# EAGLE design TMP-ASM-001 (EAGLE 9.6.2)
CNAME: Cat-Ion; CREVISION: 1.0.0; DESIGNER: Matt Starfield

## Sheet 1 of 2: MCU / Power / Mech
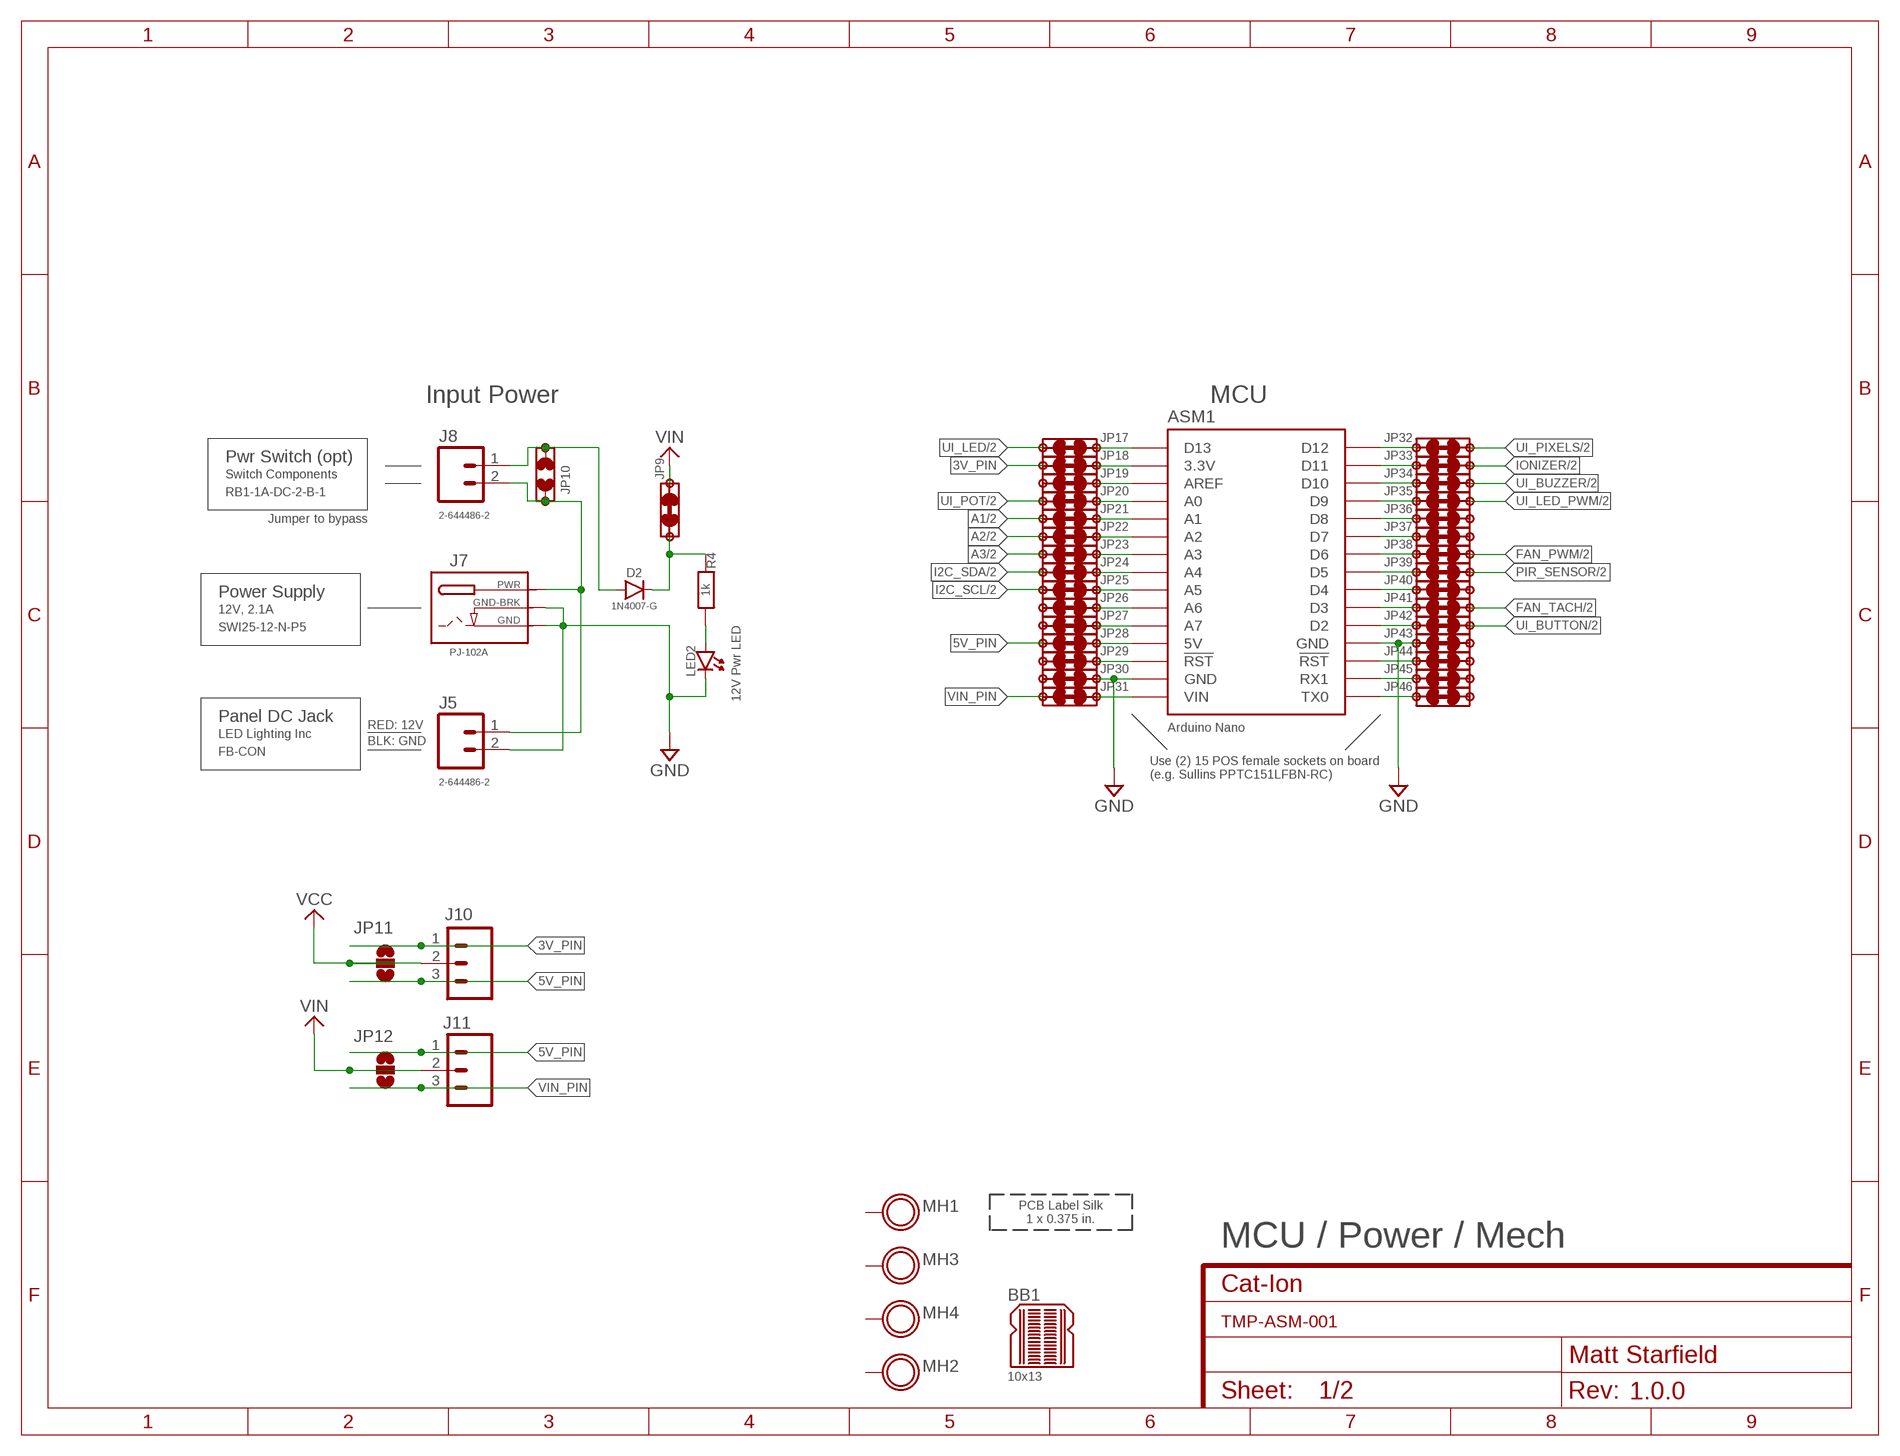
[diagram p0: schematic, sheet 1]

### Parts
ASM1  ASM_ARDUINO_NANO_NO-ICSP-LOCKING  [ASM_ARDUINO_NANO_NO-ICSP_LOCKING]
BB1  10x13  PCB_MECH_BREADBOARD_PATTERN-PROTO_10X13  [BREADBOARD_PROTO_10X13]
D2  1N4007-G  DIO_DIODE-1N4007-PTH  [DIODE-1N4007]
J5  2-644486-2  CON_HEADER_1X2-TE_MTA-100_PTH_SHROUDED  [TE_MTA-100_2POS-PTH-VERT]
J7  PJ-102A  CON_DC_BARREL_JACK-1MM-DRILL_THT_LOCKING  [DCJACK_2MM-PIN,1MM-DRILL_THT_LOCKING]
J8  2-644486-2  CON_HEADER_1X2-TE_MTA-100_PTH_SHROUDED  [TE_MTA-100_2POS-PTH-VERT]
J10  CON_HEADER_1X3LOCK  [1X03_LOCK]
J11  CON_HEADER_1X3LOCK  [1X03_LOCK]
JP9  CON_JUMPER_PTH-2-NC-0.25W_RES_VERT_DRC-FRIENDLY  [CON_JUMPER_NC_RES_VERT-0.4_DRC-FRIENDLY]
JP10  CON_JUMPER_PTH-2-NO-DRC_FRIENDLY  [CON_JUMPER_NO_RES_VERT-0.4_DRC-FRIENDLY]
JP11  CON_JUMPER_PAD-3-ALL_NOFULL_BOX_SILK  [PAD-JUMPER-3-NO_YES_SILK_FULL_BOX]
JP12  CON_JUMPER_PAD-3-ALL_NOFULL_BOX_SILK  [PAD-JUMPER-3-NO_YES_SILK_FULL_BOX]
JP17  CON_JUMPER_PTH-2-NC-0.25W_RES_VERT_DRC-FRIENDLY  [CON_JUMPER_NC_RES_VERT-0.4_DRC-FRIENDLY]
JP18  CON_JUMPER_PTH-2-NC-0.25W_RES_VERT_DRC-FRIENDLY  [CON_JUMPER_NC_RES_VERT-0.4_DRC-FRIENDLY]
JP19  CON_JUMPER_PTH-2-NC-0.25W_RES_VERT_DRC-FRIENDLY  [CON_JUMPER_NC_RES_VERT-0.4_DRC-FRIENDLY]
JP20  CON_JUMPER_PTH-2-NC-0.25W_RES_VERT_DRC-FRIENDLY  [CON_JUMPER_NC_RES_VERT-0.4_DRC-FRIENDLY]
JP21  CON_JUMPER_PTH-2-NC-0.25W_RES_VERT_DRC-FRIENDLY  [CON_JUMPER_NC_RES_VERT-0.4_DRC-FRIENDLY]
JP22  CON_JUMPER_PTH-2-NC-0.25W_RES_VERT_DRC-FRIENDLY  [CON_JUMPER_NC_RES_VERT-0.4_DRC-FRIENDLY]
JP23  CON_JUMPER_PTH-2-NC-0.25W_RES_VERT_DRC-FRIENDLY  [CON_JUMPER_NC_RES_VERT-0.4_DRC-FRIENDLY]
JP24  CON_JUMPER_PTH-2-NC-0.25W_RES_VERT_DRC-FRIENDLY  [CON_JUMPER_NC_RES_VERT-0.4_DRC-FRIENDLY]
JP25  CON_JUMPER_PTH-2-NC-0.25W_RES_VERT_DRC-FRIENDLY  [CON_JUMPER_NC_RES_VERT-0.4_DRC-FRIENDLY]
JP26  CON_JUMPER_PTH-2-NC-0.25W_RES_VERT_DRC-FRIENDLY  [CON_JUMPER_NC_RES_VERT-0.4_DRC-FRIENDLY]
JP27  CON_JUMPER_PTH-2-NC-0.25W_RES_VERT_DRC-FRIENDLY  [CON_JUMPER_NC_RES_VERT-0.4_DRC-FRIENDLY]
JP28  CON_JUMPER_PTH-2-NC-0.25W_RES_VERT_DRC-FRIENDLY  [CON_JUMPER_NC_RES_VERT-0.4_DRC-FRIENDLY]
JP29  CON_JUMPER_PTH-2-NC-0.25W_RES_VERT_DRC-FRIENDLY  [CON_JUMPER_NC_RES_VERT-0.4_DRC-FRIENDLY]
JP30  CON_JUMPER_PTH-2-NC-0.25W_RES_VERT_DRC-FRIENDLY  [CON_JUMPER_NC_RES_VERT-0.4_DRC-FRIENDLY]
JP31  CON_JUMPER_PTH-2-NC-0.25W_RES_VERT_DRC-FRIENDLY  [CON_JUMPER_NC_RES_VERT-0.4_DRC-FRIENDLY]
JP32  CON_JUMPER_PTH-2-NC-0.25W_RES_VERT_DRC-FRIENDLY  [CON_JUMPER_NC_RES_VERT-0.4_DRC-FRIENDLY]
JP33  CON_JUMPER_PTH-2-NC-0.25W_RES_VERT_DRC-FRIENDLY  [CON_JUMPER_NC_RES_VERT-0.4_DRC-FRIENDLY]
JP34  CON_JUMPER_PTH-2-NC-0.25W_RES_VERT_DRC-FRIENDLY  [CON_JUMPER_NC_RES_VERT-0.4_DRC-FRIENDLY]
JP35  CON_JUMPER_PTH-2-NC-0.25W_RES_VERT_DRC-FRIENDLY  [CON_JUMPER_NC_RES_VERT-0.4_DRC-FRIENDLY]
JP36  CON_JUMPER_PTH-2-NC-0.25W_RES_VERT_DRC-FRIENDLY  [CON_JUMPER_NC_RES_VERT-0.4_DRC-FRIENDLY]
JP37  CON_JUMPER_PTH-2-NC-0.25W_RES_VERT_DRC-FRIENDLY  [CON_JUMPER_NC_RES_VERT-0.4_DRC-FRIENDLY]
JP38  CON_JUMPER_PTH-2-NC-0.25W_RES_VERT_DRC-FRIENDLY  [CON_JUMPER_NC_RES_VERT-0.4_DRC-FRIENDLY]
JP39  CON_JUMPER_PTH-2-NC-0.25W_RES_VERT_DRC-FRIENDLY  [CON_JUMPER_NC_RES_VERT-0.4_DRC-FRIENDLY]
JP40  CON_JUMPER_PTH-2-NC-0.25W_RES_VERT_DRC-FRIENDLY  [CON_JUMPER_NC_RES_VERT-0.4_DRC-FRIENDLY]
JP41  CON_JUMPER_PTH-2-NC-0.25W_RES_VERT_DRC-FRIENDLY  [CON_JUMPER_NC_RES_VERT-0.4_DRC-FRIENDLY]
JP42  CON_JUMPER_PTH-2-NC-0.25W_RES_VERT_DRC-FRIENDLY  [CON_JUMPER_NC_RES_VERT-0.4_DRC-FRIENDLY]
JP43  CON_JUMPER_PTH-2-NC-0.25W_RES_VERT_DRC-FRIENDLY  [CON_JUMPER_NC_RES_VERT-0.4_DRC-FRIENDLY]
JP44  CON_JUMPER_PTH-2-NC-0.25W_RES_VERT_DRC-FRIENDLY  [CON_JUMPER_NC_RES_VERT-0.4_DRC-FRIENDLY]
JP45  CON_JUMPER_PTH-2-NC-0.25W_RES_VERT_DRC-FRIENDLY  [CON_JUMPER_NC_RES_VERT-0.4_DRC-FRIENDLY]
JP46  CON_JUMPER_PTH-2-NC-0.25W_RES_VERT_DRC-FRIENDLY  [CON_JUMPER_NC_RES_VERT-0.4_DRC-FRIENDLY]
LED2  LED_THT-3MM_LOCKING  [LED3MM]
MH1  PCB_MOUNTING-HOLE_PLATED-0.129-IN_#4_FREE-FIT  [MOUNTING_HOLE_0.129-IN_#4_FREE-FIT_PLATED]
MH2  PCB_MOUNTING-HOLE_PLATED-0.129-IN_#4_FREE-FIT  [MOUNTING_HOLE_0.129-IN_#4_FREE-FIT_PLATED]
MH3  PCB_MOUNTING-HOLE_PLATED-0.129-IN_#4_FREE-FIT  [MOUNTING_HOLE_0.129-IN_#4_FREE-FIT_PLATED]
MH4  PCB_MOUNTING-HOLE_PLATED-0.129-IN_#4_FREE-FIT  [MOUNTING_HOLE_0.129-IN_#4_FREE-FIT_PLATED]
R4  1k  RES_RESISTOR-PTH-1/4W_TIGHT  [AXIAL-0.3_TIGHT]
U$66  PCB_IMG_LABEL_SILK-1X0.375_IN  [LABEL_SILK_1X0.375_IN]

### Nets
3V_PIN: J10.1 JP11.1 JP18.P1
5V_PIN: J10.3 J11.1 JP11.3 JP12.1 JP28.P1
A1: JP21.P1 ; also sheet 2
A2: JP22.P1 ; also sheet 2
A3: JP23.P1 ; also sheet 2
FAN_PWM: JP38.P1 ; also sheet 2
FAN_TACH: JP41.P1 ; also sheet 2
GND: ASM1.GND@14(GND) ASM1.GND@19(GND) J5.2 J7.2(GND) J7.3(GND-BRK) JP30.P2 JP43.P2 LED2.CAT(C) ; supply symbol labelled V0_GND ; also sheet 2
I2C_SCL: JP25.P1 ; also sheet 2
I2C_SDA: JP24.P1 ; also sheet 2
IONIZER: JP33.P1 ; also sheet 2
N$1: ASM1.D12 JP32.P2
N$2: ASM1.D11 JP33.P2
N$3: ASM1.D10 JP34.P2
N$4: ASM1.D9 JP35.P2
N$5: LED2.AN(A) R4.P$1(P1)
N$6: ASM1.D8 JP36.P2
N$7: ASM1.D7 JP37.P2
N$8: ASM1.D6 JP38.P2
N$9: ASM1.D5 JP39.P2
N$10: ASM1.D4 JP40.P2
N$11: ASM1.D3 JP41.P2
N$12: ASM1.D2 JP42.P2
N$14: ASM1.RST@18(!RST!) JP44.P2
N$15: ASM1.RX1 JP45.P2
N$16: ASM1.TX0 JP46.P2
N$17: ASM1.D13 JP17.P2
N$18: J5.1 J7.1(PWR) J8.2 JP10.P1
N$19: D2.A J8.1 JP10.P2
N$20: ASM1.3.3V JP18.P2
N$24: ASM1.AREF JP19.P2
N$25: ASM1.A0 JP20.P2
N$26: ASM1.A1 JP21.P2
N$27: ASM1.A2 JP22.P2
N$28: ASM1.A3 JP23.P2
N$29: ASM1.A4 JP24.P2
N$30: ASM1.A5 JP25.P2
N$31: ASM1.A6 JP26.P2
N$33: ASM1.A7 JP27.P2
N$34: ASM1.5V JP28.P2
N$35: ASM1.RST@13(!RST!) JP29.P2
N$37: ASM1.VIN JP31.P2
N$56: D2.C JP9.P1 R4.P$2(P2)
PIR_SENSOR: JP39.P1 ; also sheet 2
UI_BUTTON: JP42.P1 ; also sheet 2
UI_BUZZER: JP34.P1 ; also sheet 2
UI_LED: JP17.P1 ; also sheet 2
UI_LED_PWM: JP35.P1 ; also sheet 2
UI_PIXELS: JP32.P1 ; also sheet 2
UI_POT: JP20.P1 ; also sheet 2
VCC: J10.2 JP11.2 ; also sheet 2
VIN: J11.2 JP9.P2 JP12.2 ; also sheet 2
VIN_PIN: J11.3 JP12.3 JP31.P1
Unconnected: JP19.P1 JP26.P1 JP27.P1 JP29.P1 JP30.P1 JP36.P1 JP37.P1 JP40.P1 JP43.P1 JP44.P1 JP45.P1 JP46.P1 MH1.P$1(P1) MH2.P$1(P1) MH3.P$1(P1) MH4.P$1(P1)

### Notes on the sheet
- Input Power | MCU
- Pwr Switch (opt)
- Switch Components
- RB1-1A-DC-2-B-1
- Jumper to bypass
- Power Supply
- 12V, 2.1A
- SWI25-12-N-P5 | 12V Pwr LED
- Panel DC Jack
- RED: 12V
- LED Lighting Inc
- BLK: GND
- FB-CON
- Use (2) 15 POS female sockets on board
  (e.g. Sullins PPTC151LFBN-RC)
- MCU / Power / Mech

## Sheet 2 of 2: Input / Output
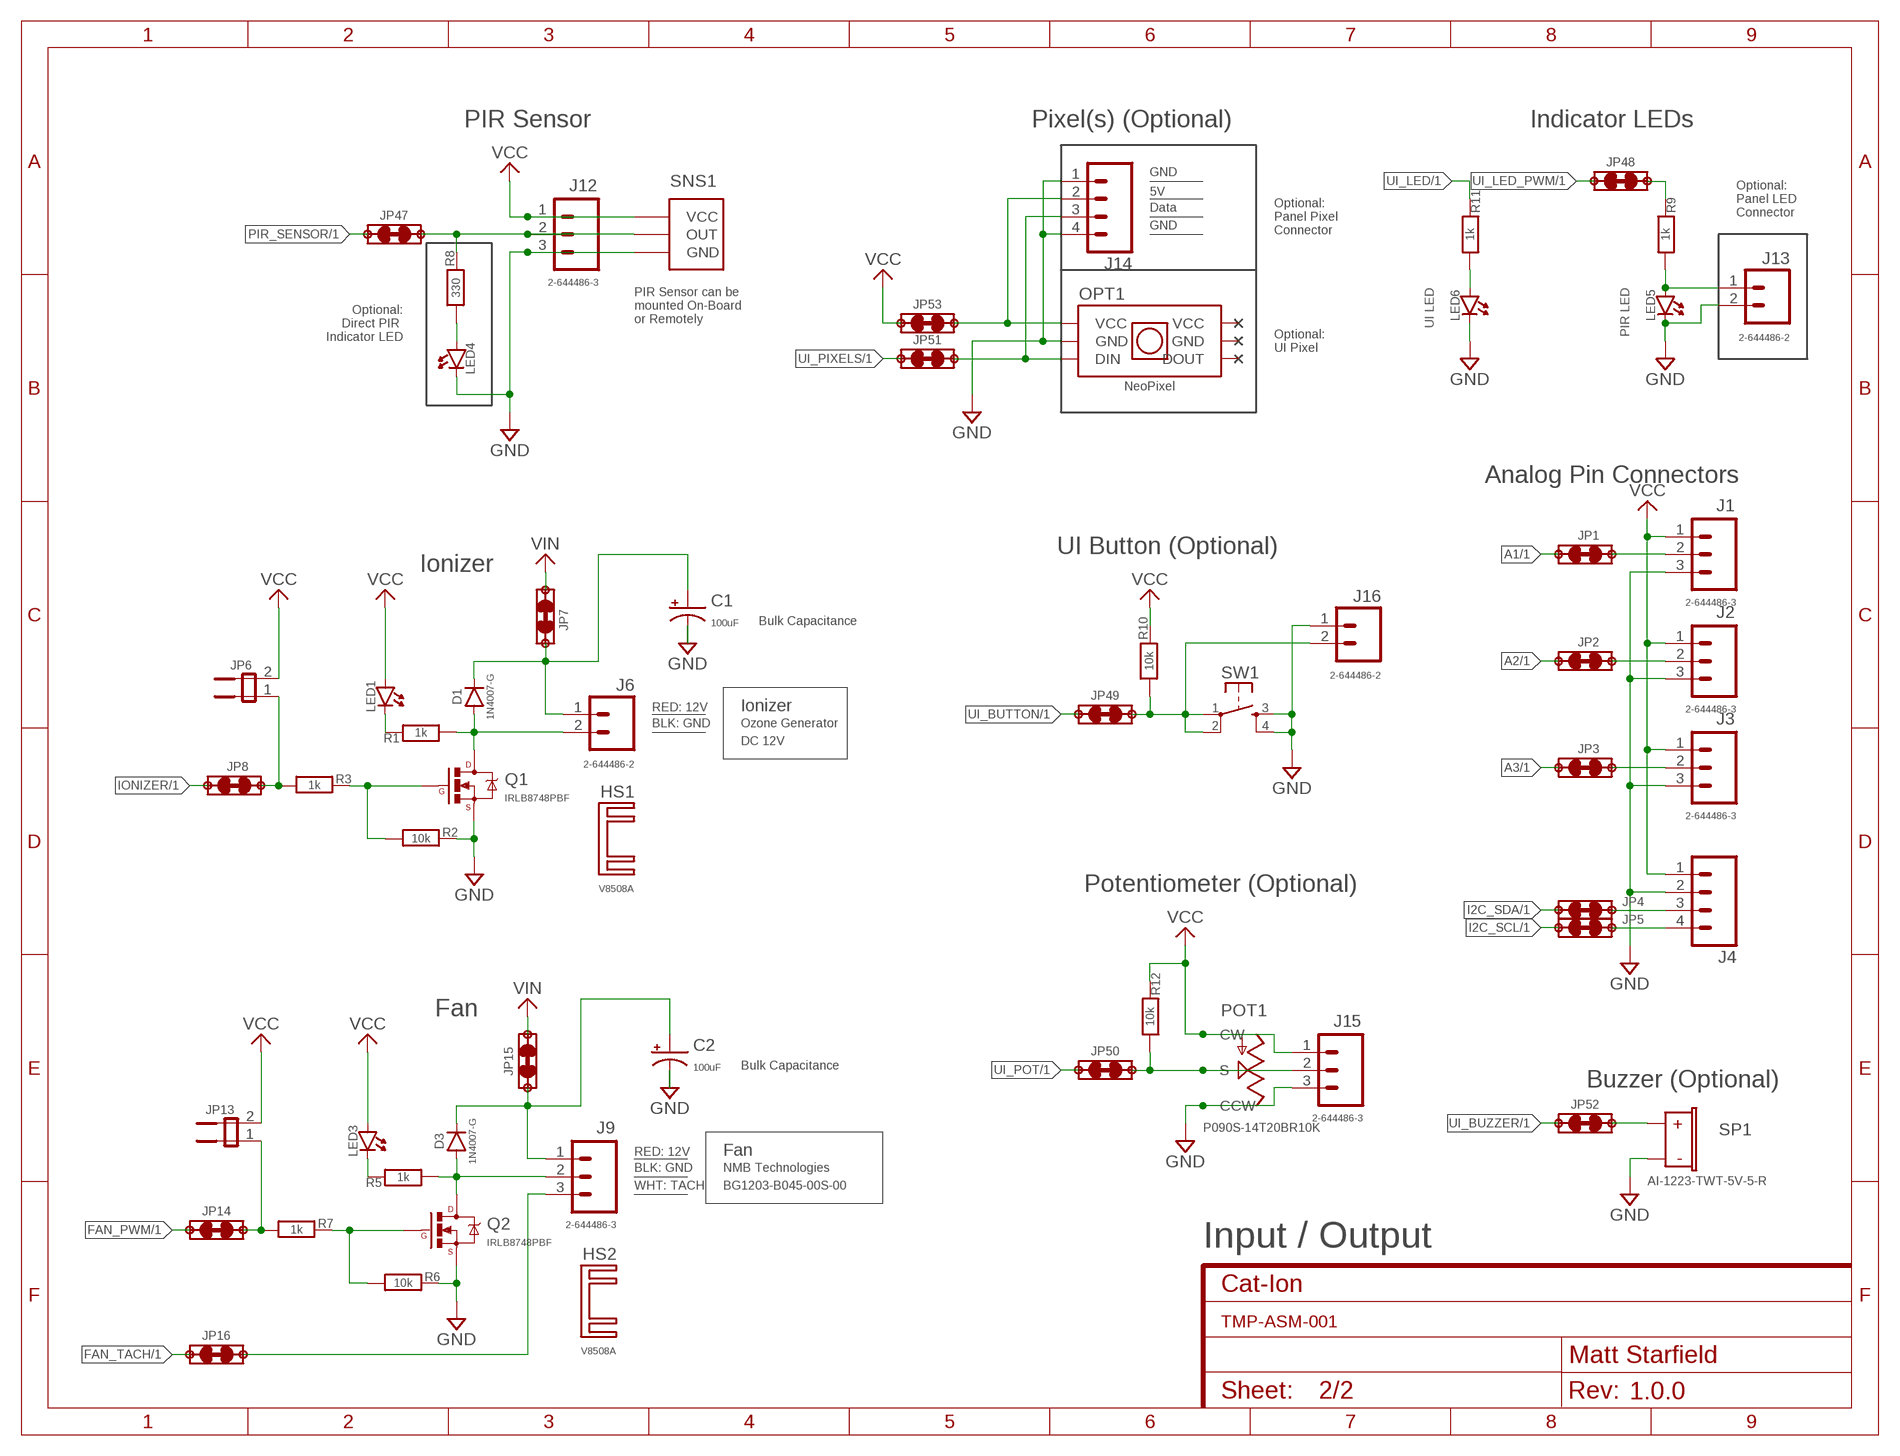
[diagram p1: schematic, sheet 2]

### Parts
C1  100uF  CAP_THT_POL-RAD-E_8MM-D_X_3MM-LEAD_POL  [CAP-E_8MM-DIA_X_3MM-LEAD]
C2  100uF  CAP_THT_POL-RAD-E_8MM-D_X_3MM-LEAD_POL  [CAP-E_8MM-DIA_X_3MM-LEAD]
D1  1N4007-G  DIO_DIODE-1N4007-PTH  [DIODE-1N4007]
D3  1N4007-G  DIO_DIODE-1N4007-PTH  [DIODE-1N4007]
HS1  V8508A  MEC_HEATSINK_NO-PIN-V8508  [HEATSINK_V8508]
HS2  V8508A  MEC_HEATSINK_NO-PIN-V8508  [HEATSINK_V8508]
J1  2-644486-3  CON_HEADER_1X3TE_MTA-100_3POS-PTH-VERT_SHROUDED  [TE_MTA-100_3POS-PTH-VERT]
J2  2-644486-3  CON_HEADER_1X3TE_MTA-100_3POS-PTH-VERT_SHROUDED  [TE_MTA-100_3POS-PTH-VERT]
J3  2-644486-3  CON_HEADER_1X3TE_MTA-100_3POS-PTH-VERT_SHROUDED  [TE_MTA-100_3POS-PTH-VERT]
J4  CON_HEADER_1X4-TE_MTA-100_PTH_SHROUDED  [TE_MTA-100_4POS-PTH-VERT]
J6  2-644486-2  CON_HEADER_1X2-TE_MTA-100_PTH_SHROUDED  [TE_MTA-100_2POS-PTH-VERT]
J9  2-644486-3  CON_HEADER_1X3TE_MTA-100_3POS-PTH-VERT_SHROUDED  [TE_MTA-100_3POS-PTH-VERT]
J12  2-644486-3  CON_HEADER_1X3TE_MTA-100_3POS-PTH-VERT_SHROUDED  [TE_MTA-100_3POS-PTH-VERT]
J13  2-644486-2  CON_HEADER_1X2-TE_MTA-100_PTH_SHROUDED  [TE_MTA-100_2POS-PTH-VERT]
J14  CON_HEADER_1X4-TE_MTA-100_PTH_SHROUDED  [TE_MTA-100_4POS-PTH-VERT]
J15  2-644486-3  CON_HEADER_1X3TE_MTA-100_3POS-PTH-VERT_SHROUDED  [TE_MTA-100_3POS-PTH-VERT]
J16  2-644486-2  CON_HEADER_1X2-TE_MTA-100_PTH_SHROUDED  [TE_MTA-100_2POS-PTH-VERT]
JP1  CON_JUMPER_PTH-2-NC-0.25W_RES_VERT_DRC-FRIENDLY  [CON_JUMPER_NC_RES_VERT-0.4_DRC-FRIENDLY]
JP2  CON_JUMPER_PTH-2-NC-0.25W_RES_VERT_DRC-FRIENDLY  [CON_JUMPER_NC_RES_VERT-0.4_DRC-FRIENDLY]
JP3  CON_JUMPER_PTH-2-NC-0.25W_RES_VERT_DRC-FRIENDLY  [CON_JUMPER_NC_RES_VERT-0.4_DRC-FRIENDLY]
JP4  CON_JUMPER_PTH-2-NC-0.25W_RES_VERT_DRC-FRIENDLY  [CON_JUMPER_NC_RES_VERT-0.4_DRC-FRIENDLY]
JP5  CON_JUMPER_PTH-2-NC-0.25W_RES_VERT_DRC-FRIENDLY  [CON_JUMPER_NC_RES_VERT-0.4_DRC-FRIENDLY]
JP6  CON_JUMPER_PIN_1X2-LOCKING  [1X02_LOCK]
JP7  CON_JUMPER_PTH-2-NC-0.25W_RES_VERT_DRC-FRIENDLY  [CON_JUMPER_NC_RES_VERT-0.4_DRC-FRIENDLY]
JP8  CON_JUMPER_PTH-2-NC-0.25W_RES_VERT_DRC-FRIENDLY  [CON_JUMPER_NC_RES_VERT-0.4_DRC-FRIENDLY]
JP13  CON_JUMPER_PIN_1X2-LOCKING  [1X02_LOCK]
JP14  CON_JUMPER_PTH-2-NC-0.25W_RES_VERT_DRC-FRIENDLY  [CON_JUMPER_NC_RES_VERT-0.4_DRC-FRIENDLY]
JP15  CON_JUMPER_PTH-2-NC-0.25W_RES_VERT_DRC-FRIENDLY  [CON_JUMPER_NC_RES_VERT-0.4_DRC-FRIENDLY]
JP16  CON_JUMPER_PTH-2-NC-0.25W_RES_VERT_DRC-FRIENDLY  [CON_JUMPER_NC_RES_VERT-0.4_DRC-FRIENDLY]
JP47  CON_JUMPER_PTH-2-NC-0.25W_RES_VERT_DRC-FRIENDLY  [CON_JUMPER_NC_RES_VERT-0.4_DRC-FRIENDLY]
JP48  CON_JUMPER_PTH-2-NC-0.25W_RES_VERT_DRC-FRIENDLY  [CON_JUMPER_NC_RES_VERT-0.4_DRC-FRIENDLY]
JP49  CON_JUMPER_PTH-2-NC-0.25W_RES_VERT_DRC-FRIENDLY  [CON_JUMPER_NC_RES_VERT-0.4_DRC-FRIENDLY]
JP50  CON_JUMPER_PTH-2-NC-0.25W_RES_VERT_DRC-FRIENDLY  [CON_JUMPER_NC_RES_VERT-0.4_DRC-FRIENDLY]
JP51  CON_JUMPER_PTH-2-NC-0.25W_RES_VERT_DRC-FRIENDLY  [CON_JUMPER_NC_RES_VERT-0.4_DRC-FRIENDLY]
JP52  CON_JUMPER_PTH-2-NC-0.25W_RES_VERT_DRC-FRIENDLY  [CON_JUMPER_NC_RES_VERT-0.4_DRC-FRIENDLY]
JP53  CON_JUMPER_PTH-2-NC-0.25W_RES_VERT_DRC-FRIENDLY  [CON_JUMPER_NC_RES_VERT-0.4_DRC-FRIENDLY]
LED1  LED_THT-3MM_LOCKING  [LED3MM]
LED3  LED_THT-3MM_LOCKING  [LED3MM]
LED4  LED_THT-3MM_LOCKING  [LED3MM]
LED5  LED_THT-3MM_LOCKING  [LED3MM]
LED6  LED_THT-3MM_LOCKING  [LED3MM]
OPT1  OPT_WS2812_ASM_ADAFRUIT_THT  [WS2812_ASM_ADAFRUIT_THT]
POT1  P090S-14T20BR10K  RES_POT-TT-P090S  [POT-TT_P090S]
Q1  IRLB8748PBF  TRN_MOSFET-N-TO-220_VERTICAL_LOCKING  [TO-220-VERTICAL-LOCKING]
Q2  IRLB8748PBF  TRN_MOSFET-N-TO-220_VERTICAL_LOCKING  [TO-220-VERTICAL-LOCKING]
R1  1k  RES_RESISTOR-PTH-1/4W_TIGHT  [AXIAL-0.3_TIGHT]
R2  10k  RES_RESISTOR-PTH-1/4W_TIGHT  [AXIAL-0.3_TIGHT]
R3  1k  RES_RESISTOR-PTH-1/4W_TIGHT  [AXIAL-0.3_TIGHT]
R5  1k  RES_RESISTOR-PTH-1/4W_TIGHT  [AXIAL-0.3_TIGHT]
R6  10k  RES_RESISTOR-PTH-1/4W_TIGHT  [AXIAL-0.3_TIGHT]
R7  1k  RES_RESISTOR-PTH-1/4W_TIGHT  [AXIAL-0.3_TIGHT]
R8  330  RES_RESISTOR-PTH-1/4W_TIGHT  [AXIAL-0.3_TIGHT]
R9  1k  RES_RESISTOR-PTH-1/4W_TIGHT  [AXIAL-0.3_TIGHT]
R10  10k  RES_RESISTOR-PTH-1/4W_TIGHT  [AXIAL-0.3_TIGHT]
R11  1k  RES_RESISTOR-PTH-1/4W_TIGHT  [AXIAL-0.3_TIGHT]
R12  10k  RES_RESISTOR-PTH-1/4W_TIGHT  [AXIAL-0.3_TIGHT]
SNS1  ASM_PIR_MOTION_SENSOR  [ASM_PIR_MOTION_SENSOR]
SP1  AI-1223-TWT-5V-5-R  EMD_BUZZER-12MM-2PIN  [BUZZER-2PIN-12MM-D]
SW1  EMD_SWITCH_SPST_MOM_THT-TL1100X_12MMX12MM  [TL1100X]

### Nets
A1: JP1.P2 ; also sheet 1
A2: JP2.P2 ; also sheet 1
A3: JP3.P2 ; also sheet 1
FAN_PWM: JP14.P2 ; also sheet 1
FAN_TACH: JP16.P2 ; also sheet 1
GND: C1.- C2.- J1.3 J2.3 J3.3 J4.2 J12.3 J13.2 J14.1 J14.4 J15.3 J16.1 LED4.CAT(C) LED5.CAT(C) LED6.CAT(C) OPT1.P$2(GND) POT1.3(CCW) Q1.3(S) Q2.3(S) R2.P$2(P2) R6.P$2(P2) SNS1.GND SP1.- SW1.3(3B) SW1.4(4B) ; supply symbol labelled V0_GND ; also sheet 1
I2C_SCL: JP5.P2 ; also sheet 1
I2C_SDA: JP4.P2 ; also sheet 1
IONIZER: JP8.P2 ; also sheet 1
N$13: LED4.AN(A) R8.P$1(P1)
N$21: LED3.CAT(C) R5.P$2(P2)
N$22: LED1.CAT(C) R1.P$2(P2)
N$23: C1.+ D1.C J6.1 JP7.P1
N$32: LED6.AN(A) R11.P$1(P1)
N$36: J9.3 JP16.P1
N$38: D3.A J9.2 Q2.2(D) R5.P$1(P1)
N$39: Q2.1(G) R6.P$1(P1) R7.P$2(P2)
N$40: J12.2 JP47.P1 R8.P$2(P2) SNS1.OUT
N$41: J13.1 LED5.AN(A) R9.P$1(P1)
N$42: JP6.1 JP8.P1 R3.P$1(P1)
N$43: C2.+ D3.C J9.1 JP15.P2
N$44: JP13.1 JP14.P1 R7.P$1(P1)
N$45: JP52.P1 SP1.+
N$46: D1.A J6.2 Q1.2(D) R1.P$1(P1)
N$47: J16.2 JP49.P1 R10.P$1(P1) SW1.1(1A) SW1.2(2A)
N$48: J14.3 JP51.P1 OPT1.P$3(DIN)
N$49: JP48.P1 R9.P$2(P2)
N$50: Q1.1(G) R2.P$1(P1) R3.P$2(P2)
N$51: J4.3 JP4.P1
N$52: J4.4 JP5.P1
N$53: J1.2 JP1.P1
N$54: J2.2 JP2.P1
N$55: J3.2 JP3.P1
N$57: J15.2 JP50.P1 POT1.2(S) R12.P$1(P1)
N$58: J14.2 JP53.P1 OPT1.P$1(VCC)
PIR_SENSOR: JP47.P2 ; also sheet 1
UI_BUTTON: JP49.P2 ; also sheet 1
UI_BUZZER: JP52.P2 ; also sheet 1
UI_LED: R11.P$2(P2) ; also sheet 1
UI_LED_PWM: JP48.P2 ; also sheet 1
UI_PIXELS: JP51.P2 ; also sheet 1
UI_POT: JP50.P2 ; also sheet 1
VCC: J1.1 J2.1 J3.1 J4.1 J12.1 J15.1 JP6.2 JP13.2 JP53.P2 LED1.AN(A) LED3.AN(A) POT1.1(CW) R10.P$2(P2) R12.P$2(P2) SNS1.VCC ; also sheet 1
VIN: JP7.P2 JP15.P1 ; also sheet 1
Unconnected: OPT1.P$4(DOUT)

### Notes on the sheet
- PIR Sensor | Pixel(s) (Optional) | Indicator LEDs
- GND
- 5V
- Optional:
  Panel LED
  Connector
- Data
- Optional:
  Panel Pixel
  Connector
- GND
- PIR Sensor can be 
  mounted On-Board
  or Remotely
- UI LED | PIR LED
- Optional:
  Direct PIR 
  Indicator LED
- Optional:
  UI Pixel
- Analog Pin Connectors
- UI Button (Optional)
- Ionizer
- Bulk Capacitance
- RED: 12V | Ionizer
- BLK: GND | Ozone Generator
- DC 12V
- Potentiometer (Optional)
- Fan
- Bulk Capacitance
- Buzzer (Optional)
- RED: 12V | Fan
- BLK: GND | NMB Technologies
- WHT: TACH | BG1203-B045-00S-00
- Input / Output

## Power pins joined to a net without a drawn wire
GND: OPT1.P$5(GND)
VCC: OPT1.P$6(VCC)

## Library data of the parts
ASM1 = MG-Eagle-Library:ASM_ARDUINO_NANO_NO-ICSP: Arduino Nano without ICSP Header Pads
BB1 = MG-Eagle-Library:PCB_MECH_BREADBOARD_PATTERN: Breadboard-Spacing Reference tDoc reference markings that correspond to solderless breadboard row spacing. Includes power rails and void space between rows.
C1 C2 = MG-Eagle-Library:CAP_THT_POL: Capacitor Standard 0603 ceramic capacitor, and 0.1" leaded capacitor.
D1-D3 = MG-Eagle-Library:DIO_DIODE: Diode These are standard reverse protection diodes and small signal diodes. SMA package can handle up to about 1A. SOD-323 can handle about 200mA. What the SOD-323 package when ordering, there are some mfgs out there that are 5-pin packages.
HS1 HS2 = MG-Eagle-Library:MEC_HEATSINK_NO-PIN
J1-J3 J9-J12 J15 = MG-Eagle-Library:CON_HEADER_1X3: Header 3 Standard 3-pin 0.1" header. Use with straight break away headers (SKU : PRT-00116), right angle break away headers (PRT-00553), swiss pins (PRT-00743), machine pins (PRT-00117), and female headers (PRT-00115). Molex polarized connector foot print use with SKU : PRT-08232 with associated crimp pins and housings.
J4 J14 = MG-Eagle-Library:CON_HEADER_1X4: Header 4 Standard 4-pin 0.1" header. Use with straight break away headers (SKU : PRT-00116), right angle break away headers (PRT-00553), swiss pins (PRT-00743), machine pins (PRT-00117), and female headers (PRT-00115). Molex polarized connector foot print use with SKU : PRT-08231 with associated crimp pins and housings. 1MM SMD Version SKU: PRT-10208
J5 J6 J8 J13 J16 = MG-Eagle-Library:CON_HEADER_1X2: Standard 2-pin 0.1" header. Use with - straight break away headers ( PRT-00116) - right angle break away headers (PRT-00553) - swiss pins (PRT-00743) - machine pins (PRT-00117) - female headers (PRT-00115) Molex polarized connector foot print use with: PRT-08233 with associated crimp pins and housings. 2.54_SCREWTERM for use with PRT-10571. 3.5mm Screw Terminal footprints for PRT-08084 5mm Screw Terminal footprints for use with PRT-08432
J7 = MG-Eagle-Library:CON_DC_BARREL_JACK: 2.0mm DC Barrel Jack DCJACK_2MM_PTH - Through Hole Jack (4UConnector: 05537)
JP1-JP5 JP7-JP9 JP14-JP53 = MG-Eagle-Library:CON_JUMPER_PTH-2-NC
JP6 JP13 = MG-Eagle-Library:CON_JUMPER_PIN_1X2: JUMPER
JP10 = MG-Eagle-Library:CON_JUMPER_PTH-2-NO
JP11 JP12 = MG-Eagle-Library:CON_JUMPER_PAD-3-ALL_NO
LED1-LED6 = MG-Eagle-Library:LED_THT: LEDs Standard schematic elements and footprints for 5mm, 3mm, 1206, and 0603 sized LEDs. 5mm - Spark Fun Electronics SKU : COM-00529 (and others); PROD_ID: DIO-08794
MH1-MH4 = MG-Eagle-Library:PCB_MOUNTING-HOLE_PLATED
OPT1 = MG-Eagle-Library:OPT_WS2812_ASM_ADAFRUIT_THT
POT1 = MG-Eagle-Library:RES_POT
Q1 Q2 = MG-Eagle-Library:TRN_MOSFET-N: Common NMOSFET Parts MFG P/N Store ID Prod ID FDD8780 TRANS-09984 SI7820DN TRANS-11055 FDS6630A IC-08089 2N7002PW TRANS-11151 FQP30N06L COM-10213 TRANS-10060 BSS123LT1G TRANS-08345 BSS138 TRANS-00830 BS170 2N7000
R1-R12 = MG-Eagle-Library:RES_RESISTOR: Resistor Basic schematic elements and footprints for 0603, 1206, and PTH resistors.
SNS1 = MG-Eagle-Library:ASM_PIR_MOTION_SENSOR
SP1 = MG-Eagle-Library:EMD_BUZZER: Buzzer Small round buzzers that operate around the audible 2kHz range. You can use these as speakers to create simple music or user interfaces. Variant Overview: PTH - Mini Speaker - PC Mount 12mm 2.048kHz <https://www.sparkfun.com/products/7950> PTH_KIT - Mini Speaker - PC Mount 12mm 2.048kHz <https://www.sparkfun.com/products/7950> KIT simplifies soldering by adding stop mask to one side of the pads. PTH_NO_SILK - Mini Speaker - PC Mount 12mm 2.048kHz <https://www.sparkfun.com/products/7950> No silkscreen indicator of buzzer outline. PTH_KIT_NO_SILK - Mini Speaker - PC Mount 12mm 2.048kHz <https://www.sparkfun.com/products/7950> KIT package w/o silkscreen SMD - Buzzer Audio Magnetic (CCV-084B16) SMD buzzer used on, e.g. the LilyPad Buzzer <https://www.sparkfun.com/products/8463> and RFID USB Reader <https://www.sparkfun.com/products/9963>. SMD_KIT - Buzzer Audio Magnetic (CCV-084B16) SMD Buzzer with elongated pins to make soldering easier. Used on the SparkFun Simon Says - Surface Mount Soldering Kit <https://www.sparkfun.com/products/10935>.
SW1 = MG-Eagle-Library:EMD_SWITCH_SPST_MOM_THT
U$66 = MG-Eagle-Library:PCB_IMG_LABEL_SILK-1X0.375_IN: Silk Area for PCB Label Sized for Online Labels #OL5400LP - 1" x 0.375" Weatherproof Polyester Laser Labels <https://www.onlinelabels.com/products/OL5400LP.htm>

## Board
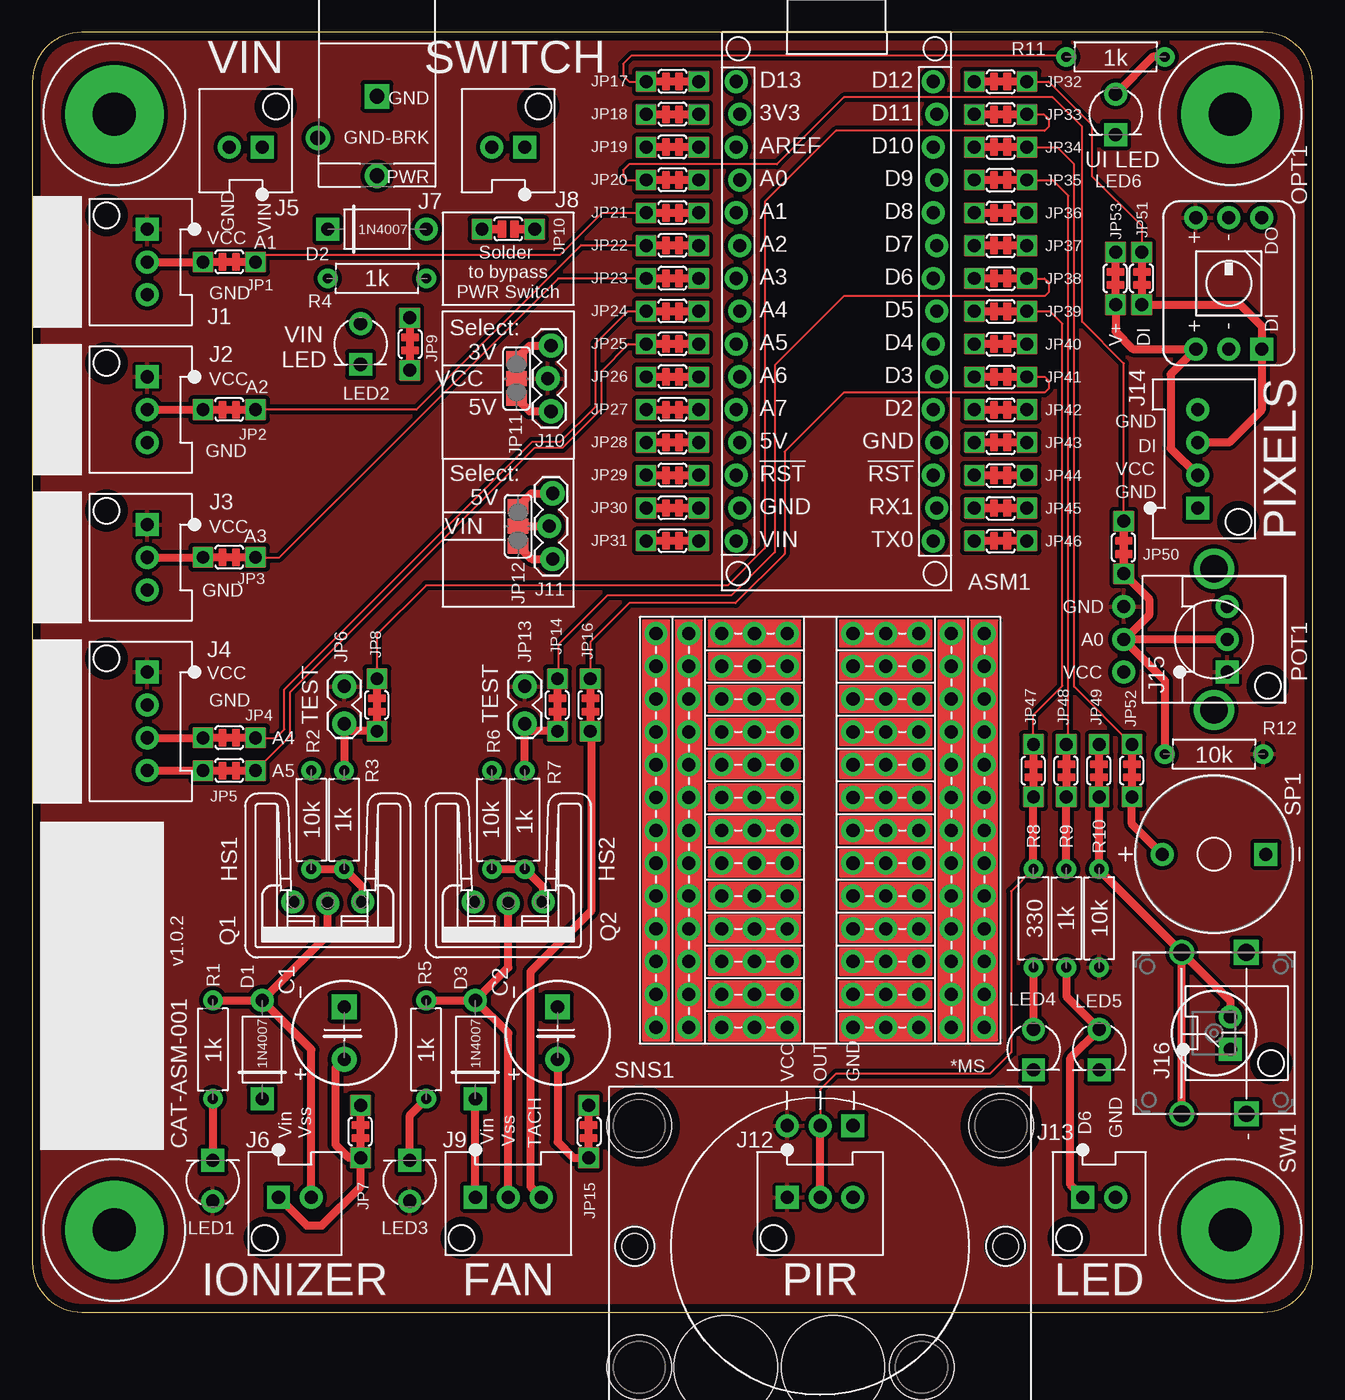
[diagram p2: board, top side]
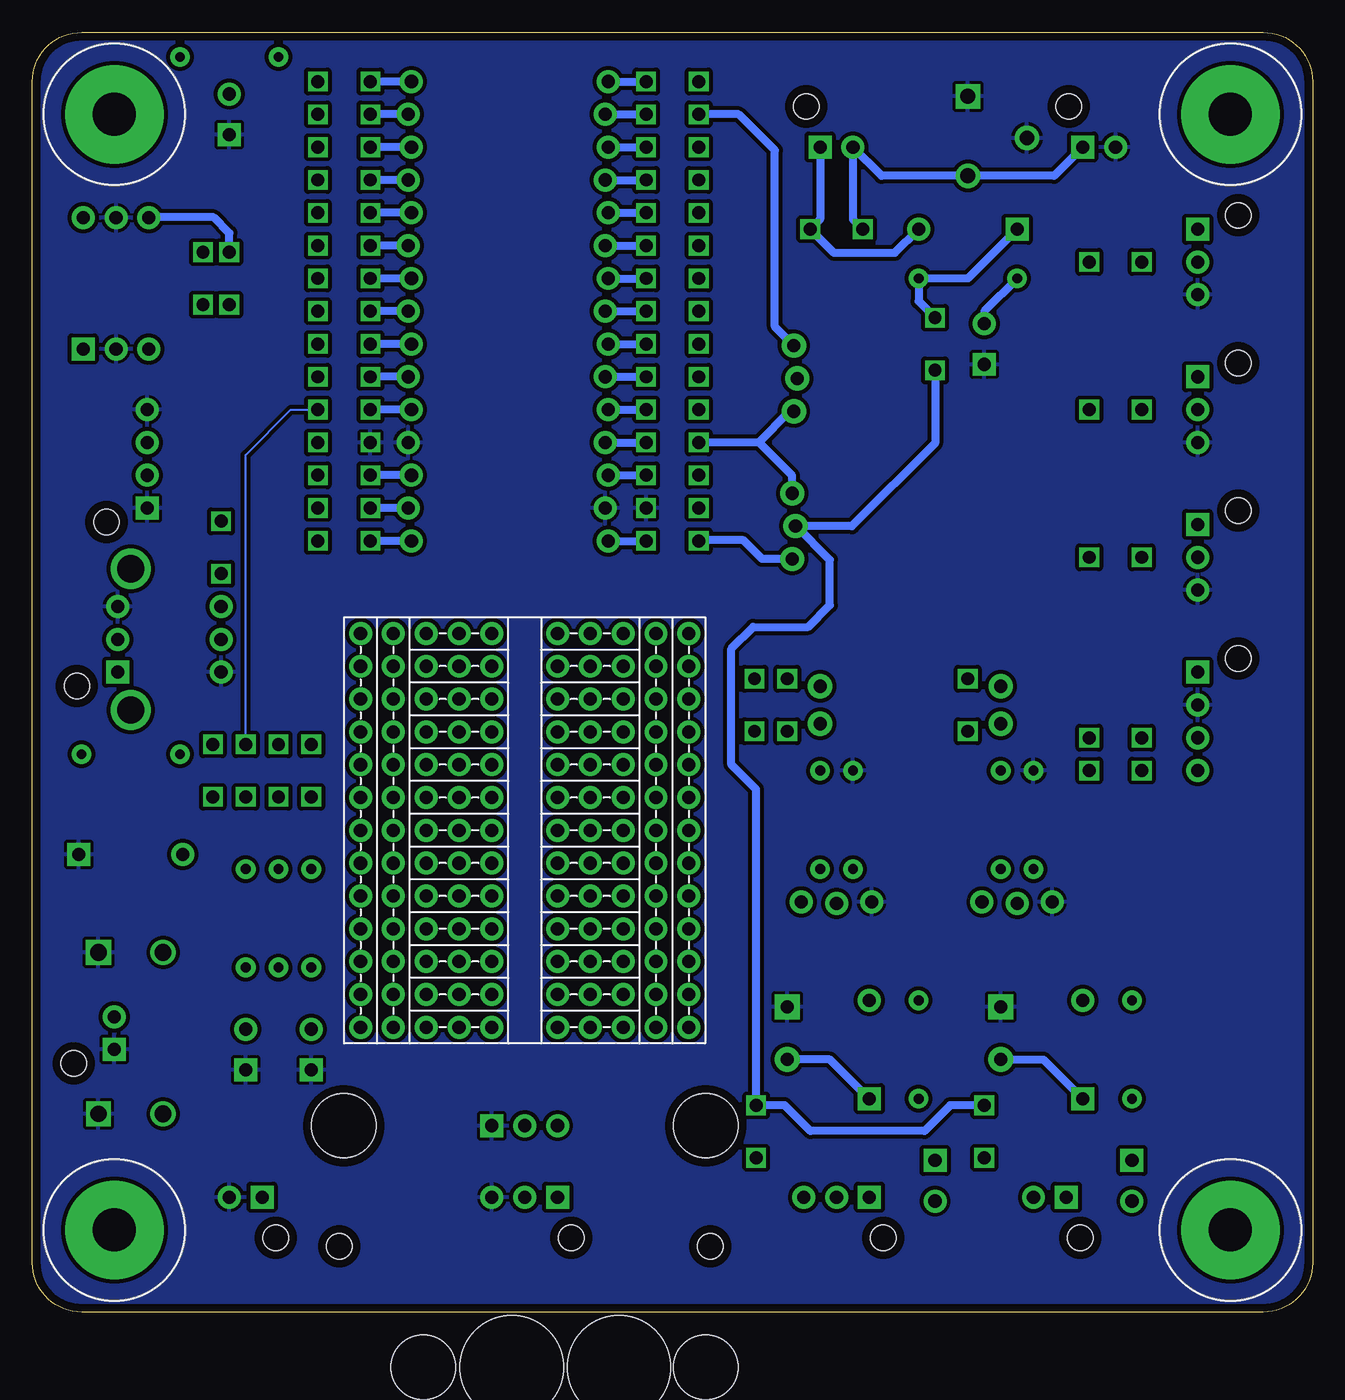
[diagram p3: board, bottom side, seen from below]

Size 99.06 x 99.06 mm. Coordinates in mm from the lower left corner, seen from the top.
Outline: 0,95.25 0,3.81 arc90 3.81,0 95.25,0 arc90 99.06,3.81 99.06,95.25 arc90 95.25,99.06 3.81,99.06 arc90 0,95.25
Copper layers (1*16): Top 0.035mm / dielectric 1.5mm / Bottom 0.035mm
Design rules "SeeedStudio_2layer_DRU_2020-09-13_MG": minimum track width 6mil, minimum drill 13mil, track to track 6mil, track to pad 6mil, pad to pad 6mil, via to via 6mil, smd to smd 0mil, copper to edge 25mil, drill to drill 10mil, minimum pad ring 6mil, minimum via ring 6mil, stop-mask expansion 2mil, vias tented up to drill 15mil, thermal gap 10mil

### Footprints (pad centres in the part's own frame; a part is rotated, then mirrored left to right if it is on the bottom)
ASM_ARDUINO_NANO_NO-ICSP_LOCKING = drill 1.016 pad 1.778: 3.3V -7.493,15.24; 5V -7.493,-10.16; A0 -7.493,10.16; A1 -7.747,7.62; A2 -7.493,5.08; A3 -7.747,2.54; A4 -7.493,0; A5 -7.747,-2.54; A6 -7.493,-5.08; A7 -7.747,-7.62; AREF -7.747,12.7; D2 7.493,-7.62; D3 7.747,-5.08; D4 7.493,-2.54; D5 7.747,0; D6 7.493,2.54; D7 7.747,5.08; D8 7.493,7.62; D9 7.747,10.16; D10 7.493,12.7; D11 7.747,15.24; D12 7.493,17.78; D13 -7.747,17.78; GND@14 -7.493,-15.24; GND@19 7.747,-10.16; RST@13 -7.747,-12.7; RST@18 7.493,-12.7; RX1 7.747,-15.24; TX0 7.493,-17.78; VIN -7.747,-17.78
BREADBOARD_PROTO_10X13 = drill 1.016 pad 1.778: P$1 -2.54,15.24; P$2 -5.08,15.24; P$3 -7.62,15.24; P$4 -10.16,15.24; P$5 -12.7,15.24; P$6 2.54,15.24; P$7 5.08,15.24; P$8 7.62,15.24; P$9 10.16,15.24; P$10 12.7,15.24; P$11 -2.54,12.7; P$12 -5.08,12.7; P$13 -7.62,12.7; P$14 -10.16,12.7; P$15 -12.7,12.7; P$16 2.54,12.7; P$17 5.08,12.7; P$18 7.62,12.7; P$19 10.16,12.7; P$20 12.7,12.7; P$21 -2.54,10.16; P$22 -5.08,10.16; P$23 -7.62,10.16; P$24 -10.16,10.16; P$25 -12.7,10.16; P$26 2.54,10.16; P$27 5.08,10.16; P$28 7.62,10.16; P$29 10.16,10.16; P$30 12.7,10.16; P$31 -2.54,7.62; P$32 -5.08,7.62; P$33 -7.62,7.62; P$34 -10.16,7.62; P$35 -12.7,7.62; P$36 2.54,7.62; P$37 5.08,7.62; P$38 7.62,7.62; P$39 10.16,7.62; P$40 12.7,7.62; P$41 -2.54,5.08; P$42 -5.08,5.08; P$43 -7.62,5.08; P$44 -10.16,5.08; P$45 -12.7,5.08; P$46 2.54,5.08; P$47 5.08,5.08; P$48 7.62,5.08; P$49 10.16,5.08; P$50 12.7,5.08; P$51 -2.54,2.54; P$52 -5.08,2.54; P$53 -7.62,2.54; P$54 -10.16,2.54; P$55 -12.7,2.54; P$56 2.54,2.54; P$57 5.08,2.54; P$58 7.62,2.54; P$59 10.16,2.54; P$60 12.7,2.54; P$61 -2.54,0; P$62 -5.08,0; P$63 -7.62,0; P$64 -10.16,0; P$65 -12.7,0; P$66 2.54,0; P$67 5.08,0; P$68 7.62,0; P$69 10.16,0; P$70 12.7,0; P$71 -2.54,-2.54; P$72 -5.08,-2.54; P$73 -7.62,-2.54; P$74 -10.16,-2.54; P$75 -12.7,-2.54; P$76 2.54,-2.54; P$77 5.08,-2.54; P$78 7.62,-2.54; P$79 10.16,-2.54; P$80 12.7,-2.54; P$81 -2.54,-5.08; P$82 -5.08,-5.08; P$83 -7.62,-5.08; P$84 -10.16,-5.08; P$85 -12.7,-5.08; P$86 2.54,-5.08; P$87 5.08,-5.08; P$88 7.62,-5.08; P$89 10.16,-5.08; P$90 12.7,-5.08; P$91 -2.54,-15.24; P$92 -5.08,-15.24; P$93 -7.62,-15.24; P$94 -10.16,-15.24; P$95 -12.7,-15.24; P$96 2.54,-15.24; P$97 5.08,-15.24; P$98 7.62,-15.24; P$99 10.16,-15.24; P$100 12.7,-15.24; P$101 -2.54,-7.62; P$102 -5.08,-7.62; P$103 -7.62,-7.62; P$104 -10.16,-7.62; P$105 -12.7,-7.62; P$106 2.54,-7.62; P$107 5.08,-7.62; P$108 7.62,-7.62; P$109 10.16,-7.62; P$110 12.7,-7.62; P$111 -2.54,-10.16; P$112 -5.08,-10.16; P$113 -7.62,-10.16; P$114 -10.16,-10.16; P$115 -12.7,-10.16; P$116 2.54,-10.16; P$117 5.08,-10.16; P$118 7.62,-10.16; P$119 10.16,-10.16; P$120 12.7,-10.16; P$121 -2.54,-12.7; P$122 -5.08,-12.7; P$123 -7.62,-12.7; P$124 -10.16,-12.7; P$125 -12.7,-12.7; P$126 2.54,-12.7; P$127 5.08,-12.7; P$128 7.62,-12.7; P$129 10.16,-12.7; P$130 12.7,-12.7
CAP-E_8MM-DIA_X_3MM-LEAD = drill 1.016 pad 1.93: + -2.032,0 | drill 1.016 pad 1.93 square: - 2.032,0
DIODE-1N4007 = drill 1.016 pad 1.778: A -3.81,0 | drill 1.016 pad 1.778 square: C 3.81,0
TE_MTA-100_3POS-PTH-VERT = drill 1.016 pad 1.778 square: 1 -3.81,0 | drill 1.016 pad 1.778: 2 -1.27,0; 3 1.27,0 | hole 1.981: -4.877,-3.15
TE_MTA-100_4POS-PTH-VERT = drill 1.016 pad 1.778 square: 1 -3.81,0 | drill 1.016 pad 1.778: 2 -1.27,0; 3 1.27,0; 4 3.81,0 | hole 1.981: -4.877,-3.15
TE_MTA-100_2POS-PTH-VERT = drill 1.016 pad 1.778 square: 1 -1.27,0 | drill 1.016 pad 1.778: 2 1.27,0 | hole 1.981: -2.337,-3.15
DCJACK_2MM-PIN,1MM-DRILL_THT_LOCKING = drill 1.143 pad 1.905: 1 0,6.027; 3 4.573,3.1 | drill 1.143 pad 1.905 square: 2 0,-0.127
1X03_LOCK = drill 1.016 pad 1.88: 1 0,0.127; 2 2.54,-0.127; 3 5.08,0.127
CON_JUMPER_NC_RES_VERT-0.4_DRC-FRIENDLY = drill 1 pad 1.524 square: P1 -2.032,0; P2 2.032,0
1X02_LOCK = drill 1.016 pad 1.88: 1 -0.178,0; 2 2.718,0
CON_JUMPER_NO_RES_VERT-0.4_DRC-FRIENDLY = drill 1 pad 1.524 square: P1 -2.032,0; P2 2.032,0
PAD-JUMPER-3-NO_YES_SILK_FULL_BOX = smd 1.168 x 1.6: 1 -1.524,0; 2 0,0; 3 1.524,0
LED3MM = drill 1.016 pad 1.778: AN -1.575,0 | drill 1.016 pad 1.778 square: CAT 1.575,0
MOUNTING_HOLE_0.129-IN_#4_FREE-FIT_PLATED = drill 3.327 pad 7.62: P$1 0,0
WS2812_ASM_ADAFRUIT_THT = drill 1.016 pad 1.778: P$1 -5.08,2.54; P$2 -5.08,0; P$4 5.08,-2.54; P$5 5.08,0; P$6 5.08,2.54 | drill 1.016 pad 1.778 square: P$3 -5.08,-2.54
POT-TT_P090S = drill 1.016 pad 1.778: 1 -2.54,-6.985; 2 0,-6.985; 3 2.54,-6.985 | drill 2.1: 4 -5.461,0; 5 5.461,0
TO-220-VERTICAL-LOCKING = drill 1.016 pad 1.778: 1 -2.718,0; 2 0,0.127; 3 2.718,0
AXIAL-0.3_TIGHT = drill 0.762 pad 1.524: P$1 -3.81,0; P$2 3.81,0
ASM_PIR_MOTION_SENSOR = drill 1.016 pad 1.778 square: GND -2.54,-9.35 | drill 1.016 pad 1.778: OUT 0,-9.35; VCC 2.54,-9.35 | hole 2: -14.35,0; 14.35,0 | hole 5: 14,-9.35; -14,-9.35; 14,9.35; -7.85,9.35 | hole 8: -1,9.35; 7.3,9.35
BUZZER-2PIN-12MM-D = drill 1.016 pad 1.778: + -4.013,0 | drill 1.016 pad 1.778 square: - 4.013,0
TL1100X = drill 1.3: 1 -6.25,-2.5; 2 6.25,-2.5 | drill 1.3 square: 3 -6.25,2.5 | drill 1.27 square: 4 6.25,2.5

### Placement (x,y rotation side)
ASM1  62.23,77.47 0 top
BB1  60.96,37.29 0 top
C1  24.13,21.59 90 top
C2  40.64,21.59 90 top
D1  17.78,20.32 270 top
D2  26.67,83.82 180 top
D3  34.29,20.32 270 top
HS1  22.86,31.75 270 top
HS2  36.83,31.75 270 top
J1  8.89,80.01 270 top
J2  8.89,68.58 270 top
J3  8.89,57.15 270 top
J4  8.89,45.72 270 top
J5  16.51,90.17 180 top
J6  20.32,8.89 0 top
J7  26.67,93.98 180 top
J8  36.83,90.17 180 top
J9  38.1,8.89 0 top
J10  40.01,74.8 270 top
J11  40.13,63.37 270 top
J12  62.23,8.89 0 top
J13  82.55,8.89 0 top
J14  90.17,66.04 90 top
J15  92.46,53.34 90 top
J16  92.71,21.59 90 top
JP1  15.24,81.28 0 top
JP2  15.24,69.85 0 top
JP3  15.24,58.42 0 top
JP4  15.24,44.45 0 top
JP5  15.24,41.91 0 top
JP6  24.13,45.72 90 top
JP7  25.4,13.97 90 top
JP8  26.67,46.99 90 top
JP9  29.21,74.93 270 top
JP10  36.83,83.82 0 top
JP11  37.47,72.26 270 top
JP12  37.59,60.83 270 top
JP13  38.1,45.72 90 top
JP14  40.64,46.99 90 top
JP15  43.05,13.97 270 top
JP16  43.18,46.99 90 top
JP17  49.53,95.25 0 top
JP18  49.53,92.71 0 top
JP19  49.53,90.17 0 top
JP20  49.53,87.63 0 top
JP21  49.53,85.09 0 top
JP22  49.53,82.55 0 top
JP23  49.53,80.01 0 top
JP24  49.53,77.47 0 top
JP25  49.53,74.93 0 top
JP26  49.53,72.39 0 top
JP27  49.53,69.85 0 top
JP28  49.53,67.31 0 top
JP29  49.53,64.77 0 top
JP30  49.53,62.23 0 top
JP31  49.53,59.69 0 top
JP32  74.93,95.25 180 top
JP33  74.93,92.71 180 top
JP34  74.93,90.17 180 top
JP35  74.93,87.63 180 top
JP36  74.93,85.09 180 top
JP37  74.93,82.55 180 top
JP38  74.93,80.01 180 top
JP39  74.93,77.47 180 top
JP40  74.93,74.93 180 top
JP41  74.93,72.39 180 top
JP42  74.93,69.85 180 top
JP43  74.93,67.31 180 top
JP44  74.93,64.77 180 top
JP45  74.93,62.23 180 top
JP46  74.93,59.69 180 top
JP47  77.47,41.91 90 top
JP48  80.01,41.91 90 top
JP49  82.55,41.91 90 top
JP50  84.45,59.18 90 top
JP51  85.85,80.01 90 top
JP52  85.09,41.91 90 top
JP53  83.82,80.01 90 top
LED1  13.97,10.16 90 top
LED2  25.4,74.93 270 top
LED3  29.21,10.16 90 top
LED4  77.47,20.32 270 top
LED5  82.55,20.32 270 top
LED6  83.82,92.71 270 top
MH1  6.35,92.71 0 top
MH2  6.35,6.35 0 top
MH3  92.71,92.71 0 top
MH4  92.71,6.35 0 top
OPT1  92.58,79.63 90 top
POT1  91.44,52.07 270 top
Q1  22.86,31.75 180 top
Q2  36.83,31.75 180 top
R1  13.97,20.32 270 top
R2  21.59,38.1 90 top
R3  24.13,38.1 270 top
R4  26.67,80.01 0 top
R5  30.48,20.32 270 top
R6  35.56,38.1 90 top
R7  38.1,38.1 270 top
R8  77.47,30.48 90 top
R9  80.01,30.48 90 top
R10  82.55,30.48 270 top
R11  83.82,97.16 180 top
R12  91.44,43.18 0 top
SNS1  60.96,5.08 180 top
SP1  91.44,35.43 0 top
SW1  91.44,21.59 270 top
U$66  5.38,25.25 270 top

### Tracks (layer width: path | path; a pad name or v marks a point on that pad's centre or on a via)
3V_PIN
  Top 0.61: JP11.1 38.48,74.8 J10.1
  Bottom 0.61: J10.1 41.6,76.28 41.6,89.92 44.4,92.71 JP18.P1
5V_PIN
  Top 0.61: JP12.1 38.61,63.37 J11.1 | JP11.3 38.48,69.72 J10.3
  Bottom 0.61: J11.1 40.26,64.75 42.82,67.31 JP28.P1 42.85,67.31 40.44,69.72 J10.3
A1
  Top 0.152: JP1.P2 17.83,81.84 40.84,81.84 44.09,85.09 JP21.P1
A2
  Top 0.152: JP22.P1 47.45,82.6 42.47,82.6 29.72,69.85 JP2.P2
A3
  Top 0.152: JP23.P1 40.69,80.01 19.05,58.37 17.32,58.37 JP3.P2
FAN_PWM
  Top 0.152: JP38.P1 78.33,80.01 78.64,79.7 78.64,78.94 78.33,78.64 62.79,78.64 57.45,73.3 57.45,58.83 54.1,55.47 44.5,55.47 40.69,51.66 40.69,49.07 JP14.P2
FAN_TACH
  Top 0.152: JP41.P1 78.33,72.39 78.64,72.08 78.64,71.48 78.33,71.17 62.79,71.17 58.22,66.6 58.22,58.67 54.41,54.86 46.18,54.86 43.18,51.87 JP16.P2
GND
  pour Bottom (isolate 0.305): -1.27,100.33 -1.27,-2.54 101.6,-2.54 101.6,100.33
I2C_SCL
  Top 0.152: JP5.P2 19.96,44.6 19.96,48.01 38.86,66.9 41.03,66.9 44.04,69.92 44.04,72.85 46.13,74.93 JP25.P1
I2C_SDA
  Top 0.152: JP4.P2 18.85,44.45 19.51,45.11 19.51,48.2 38.67,67.36 40.84,67.36 43.59,70.1 43.59,74.98 46.08,77.47 JP24.P1
IONIZER
  Top 0.152: JP33.P1 78.28,92.71 78.64,92.35 78.64,91.75 78.33,91.44 62.18,91.44 56.69,85.95 56.69,59.13 53.8,56.24 30.48,56.24 26.67,52.43 JP8.P2
N$1
  Bottom 0.61: ASM1.D12 JP32.P2
N$2
  Bottom 0.61: ASM1.D11 JP33.P2
N$3
  Bottom 0.61: ASM1.D10 JP34.P2
N$4
  Bottom 0.61: ASM1.D9 JP35.P2
N$5
  Bottom 0.61: R4.P$1 25.4,77.47 LED2.AN
N$6
  Bottom 0.61: ASM1.D8 JP36.P2
N$7
  Bottom 0.61: ASM1.D7 JP37.P2
N$8
  Bottom 0.61: ASM1.D6 JP38.P2
N$9
  Bottom 0.61: ASM1.D5 JP39.P2
N$10
  Bottom 0.61: ASM1.D4 JP40.P2
N$11
  Bottom 0.61: ASM1.D3 JP41.P2
N$12
  Bottom 0.61: ASM1.D2 JP42.P2
N$13
  Top 0.61: R8.P$1 LED4.AN
N$14
  Bottom 0.61: ASM1.RST@18 JP44.P2
N$15
  Bottom 0.61: ASM1.RX1 JP45.P2
N$16
  Bottom 0.61: ASM1.TX0 JP46.P2
N$17
  Bottom 0.61: ASM1.D13 JP17.P2
N$18
  Bottom 0.61: J5.1 20,87.95 J7.1 33.34,87.95 J8.2 35.56,84.58 JP10.P1
N$19
  Bottom 0.61: J8.1 38.1,84.58 JP10.P2 37.03,81.99 32.31,81.99 D2.A
N$20
  Bottom 0.61: ASM1.3.3V JP18.P2
N$21
  Top 0.61: LED3.CAT 29.21,15.24 R5.P$2
N$22
  Top 0.61: R1.P$2 LED1.CAT
N$23
  Top 0.61: C1.+ 23.47,18.9 23.47,12.95 24.49,11.94 JP7.P1 25.4,9.7 22.4,6.71 21.23,6.71 J6.1
  Bottom 0.61: C1.+ 20.83,19.56 D1.C
N$24
  Bottom 0.61: ASM1.AREF JP19.P2
N$25
  Bottom 0.61: ASM1.A0 JP20.P2
N$26
  Bottom 0.61: ASM1.A1 JP21.P2
N$27
  Bottom 0.61: ASM1.A2 JP22.P2
N$28
  Bottom 0.61: ASM1.A3 JP23.P2
N$29
  Bottom 0.61: ASM1.A4 JP24.P2
N$30
  Bottom 0.61: ASM1.A5 JP25.P2
N$31
  Bottom 0.61: ASM1.A6 JP26.P2
N$32
  Top 0.61: R11.P$1 86.69,97.16 LED6.AN
N$33
  Bottom 0.61: ASM1.A7 JP27.P2
N$34
  Bottom 0.61: ASM1.5V JP28.P2
N$35
  Bottom 0.61: ASM1.RST@13 JP29.P2
N$36
  Top 0.61: J9.3 38.56,9.7 38.56,26.36 43.28,31.09 43.28,44.86 JP16.P1
N$37
  Bottom 0.61: ASM1.VIN JP31.P2
N$38
  Top 0.61: R5.P$1 D3.A | J9.2 36.83,21.59 D3.A | D3.A 36.83,26.67 Q2.2
N$39
  Top 0.61: Q2.1 39.52,32.87 R7.P$2 R6.P$1
N$40
  Top 0.152: R8.P$2 75.74,32.56 75.74,20.12 74.07,18.44 62.18,18.44 60.96,17.22 SNS1.OUT
  Top 0.61: J12.2 SNS1.OUT | R8.P$2 JP47.P1
N$41
  Top 0.61: J13.1 80.31,9.86 80.31,19.66 LED5.AN 80.01,24.43 R9.P$1
N$42
  Top 0.61: R3.P$1 JP6.1 24.71,44.96 JP8.P1
N$43
  Top 0.61: C2.+ 40.64,13.16 41.86,11.94 JP15.P2 | J9.1 D3.C
  Bottom 0.61: D3.C 37.34,19.56 C2.+
N$44
  Top 0.61: R7.P$1 JP13.1 38.68,44.96 JP14.P1
N$45
  Top 0.61: SP1.+ 85.09,37.77 JP52.P1
N$46
  Top 0.61: R1.P$1 D1.A | D1.A 22.86,29.21 Q1.2 | J6.2 21.59,20.32 D1.A
N$47
  Top 0.61: SW1.2 SW1.1 | SW1.1 82.55,34.23 R10.P$1 JP49.P1 | SW1.1 92.71,24.07 J16.2
N$48
  Top 0.61: JP51.P1 93.47,77.98 95.12,76.33 OPT1.P$3 95.12,69.83 92.61,67.31 J14.3
N$49
  Top 0.61: R9.P$2 JP48.P1
N$50
  Top 0.61: R2.P$1 R3.P$2 25.55,32.87 Q1.1
N$51
  Top 0.61: J4.3 JP4.P1
N$52
  Top 0.61: J4.4 JP5.P1
N$53
  Top 0.61: J1.2 JP1.P1
N$54
  Top 0.61: J2.2 JP2.P1
N$55
  Top 0.61: J3.2 JP3.P1
N$56
  Bottom 0.61: D2.C 26.67,80.01 R4.P$2 30.48,78.23 JP9.P1
N$57
  Top 0.61: J15.2 POT1.2 | JP50.P1 86.41,55.19 86.41,53.95 84.53,52.07 POT1.2 | POT1.2 87.63,48.88 R12.P$1
N$58
  Top 0.61: JP53.P1 83.82,75.89 85.17,74.55 OPT1.P$1 88.09,72.59 88.09,66.85 J14.2
PIR_SENSOR
  Top 0.152: JP47.P2 77.47,46.23 79.7,48.46 79.7,76.5 78.74,77.47 JP39.P1
UI_BUTTON
  Bottom 0.152: JP49.P2 82.55,66.34 79.05,69.85 JP42.P1
UI_BUZZER
  Top 0.152: JP34.P1 79.3,90.17 80.62,88.85 80.62,48.41 JP52.P2
UI_LED
  Top 0.152: R11.P$2 79.93,97.23 46.33,97.23 45.72,96.62 45.72,95.71 46.18,95.25 JP17.P1
UI_LED_PWM
  Top 0.152: JP48.P2 80.16,44.09 80.16,86.41 78.94,87.63 JP35.P1
UI_PIXELS
  Top 0.152: JP32.P1 78.64,95.25 81.99,91.9 81.99,87.94 85.85,84.07 JP51.P2
UI_POT
  Top 0.152: JP50.P2 84.45,73.43 81.23,76.66 81.23,91.75 78.94,94.03 62.79,94.03 57.61,88.85 46.18,88.85 45.72,88.39 45.72,87.94 46.02,87.63 JP20.P1
VCC
  Bottom 0.61: JP53.P2 83.82,83.52 85.04,84.73 90.02,84.73 OPT1.P$6
  pour Top (isolate 0.305): -2.54,100.33 -2.54,-2.54 101.6,-2.54 101.6,101.6 -2.54,101.6
VIN
  Top 0.61: JP12.2 J11.2
  Bottom 0.61: JP9.P2 29.21,67.26 35.64,60.83 J11.2 39.95,60.83 37.34,58.22 37.34,54.71 39.01,53.03 43.28,53.03 44.96,51.36 44.96,42.37 43.05,40.46 JP15.P1 40.84,16 38.86,14.02 30.02,14.02 28.04,16 JP7.P2
VIN_PIN
  Top 0.61: JP12.3 38.61,58.29 J11.3
  Bottom 0.61: J11.3 42.6,58.29 44.04,59.74 47.45,59.74 JP31.P1

### Text on the board
tPlace: VIN | SWITCH | 1k | UI LED | GND | VIN | VCC | A1 | Solder / to bypass / PWR Switch | 1k | GND | V+ | VIN / LED | Select: | DI | 3V | VCC | A2 | VCC | 5V | GND | GND | DI | PIXELS | Select: | VCC | GND | 5V | VCC | VIN | A3 | GND | GND | A0 | VCC | VCC | TEST | TEST | GND | A4 | 10k | A5 | 10k | 1k | 10k | 1k | 330 | 1k | 10k | v1.0.2 | 1k | 1k | *MS | VCC | OUT | GND | D6 | - | CAT-ASM-001 | Vin | Vss | Vin | Vss | TACH | GND | IONIZER | FAN | PIR | LED
Document: Template PCB Design Objectives: / ---------------------------------------- / - Modular/Adaptable PCB design that includes common features & capabilities required for most projects / / - Extensible design to allow application-specific capabilities / / - Built-in footprints for both Arduino Nano and Adafruit Feather Dev Boards / * Feather Dev Boards provide a stackable format to add expansion boards / / - PCB Dimensions / Layers for cheap, quick turn fab (JLCPCB, PCBWay, etc) / * 2 layer / * less than 100 mm² (3.937 in²) / / - PCB Dimensions / Mounting for Enclosure / * Hammond Enclosures have a wide variety of options and are readily available through Digikey / * maximize compatibilty for various enclosure options / * 4.06 in Wide Extruded Aluminum https://www.hammfg.com/electronics/small-case/extruded/1455 / * 4.72 in² Plastic Enclosures https://www.hammfg.com/electronics/small-case/plastic/1557 | - Layer 200 tBMP contains candidate PCB dimension / shape for Hammond 4.7x4.7in enclosures. / - requires layout changes to accomodate / - include clearance for screw heads!
tDocu: Board Updates: / ------------------------------------------- / - Rearrange layout to fit general enclosure shape (see above). Consider: / * https://www.digikey.com/short/9n8tjtbp / * https://www.digikey.com/short/50mbfthm / * https://www.digikey.com/short/w32mjmr3 / / - Include footprint for Feather dev board. See routing for "the Shield" adapter / * add pin labels to bottom side / * Change/move MCU pin jumper labels to make more room / / - Replace Breadboard prototype area with additional Feather footprint / * adjust footprint placement to allow feather board edge to aligh with enclosure wall / * provides space for more expansion boards (lower stack height) / * provides accessibility to tops of all feather boards / * allows use of Featherwing boards with Nano as the base MCU / * can use $5 Feather Proto Board to replace Breadboard prototype area / * this area can alternatively be used for app-specific board-mount components / / - rotate LED1 LED3 180° to match orientation of other LEDs / / - update J7 label from PWR to Vin / / - combine OPT1 and J14 to overlap / - rotate OPT1 90° / - move JP53, JP51 / / - Make Fan Conn 4-pin: Vin, Vss, Tach, PWM / / - modify SW1 footprint to include: / - 2-pin Conn / - footprint for smaller switch / https://www.digikey.com/en/products/detail/omron-electronics-inc-emc-div/B3W-1052/31779 / / - add 2nd tactile switch / / - modify POT1 section to accomodate Encoder / https://www.digikey.com/en/products/detail/bourns-inc/PEC11R-4215F-S0024/4499665 / / - add Vreg footprint to Vin section / https://www.digikey.com/en/products/detail/recom-power/R-78E5.0-1.0/4930585 / / - ? make all Conn labels silk screen blocks; no permanent names/labels